# Altium schematic sheet AMS1117_5-3.3V.SchDoc
size 254 x 127 mm
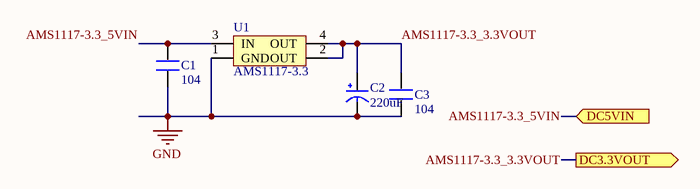
[diagram p0: AMS1117_5-3.3V.SchDoc]

## Parts
C1  104  [0603P]
C2  220uF  [CC6.56.5]
C3  104  [0603P]
U1  AMS1117-3.3  [AMS1117]

## Ports
DC3.3VOUT (out), DC5VIN (in)

## Nets
GND: C1.1 C2.2(GND) C3.1 U1.1(GND)
AMS1117-3.3_3.3VOUT: C2.1(VCC) C3.2 U1.2(OUT) U1.4(OUT) ; port DC3.3VOUT
AMS1117-3.3_5VIN: C1.2 U1.3(IN) ; port DC5VIN

## Library data of the parts
C1 C3 = C
C2 = CAP
U1 = AMS1117